# Altium schematic sheet Control.SchDoc: Control Module
size A3; SheetNumber: 2; SheetTotal: 7
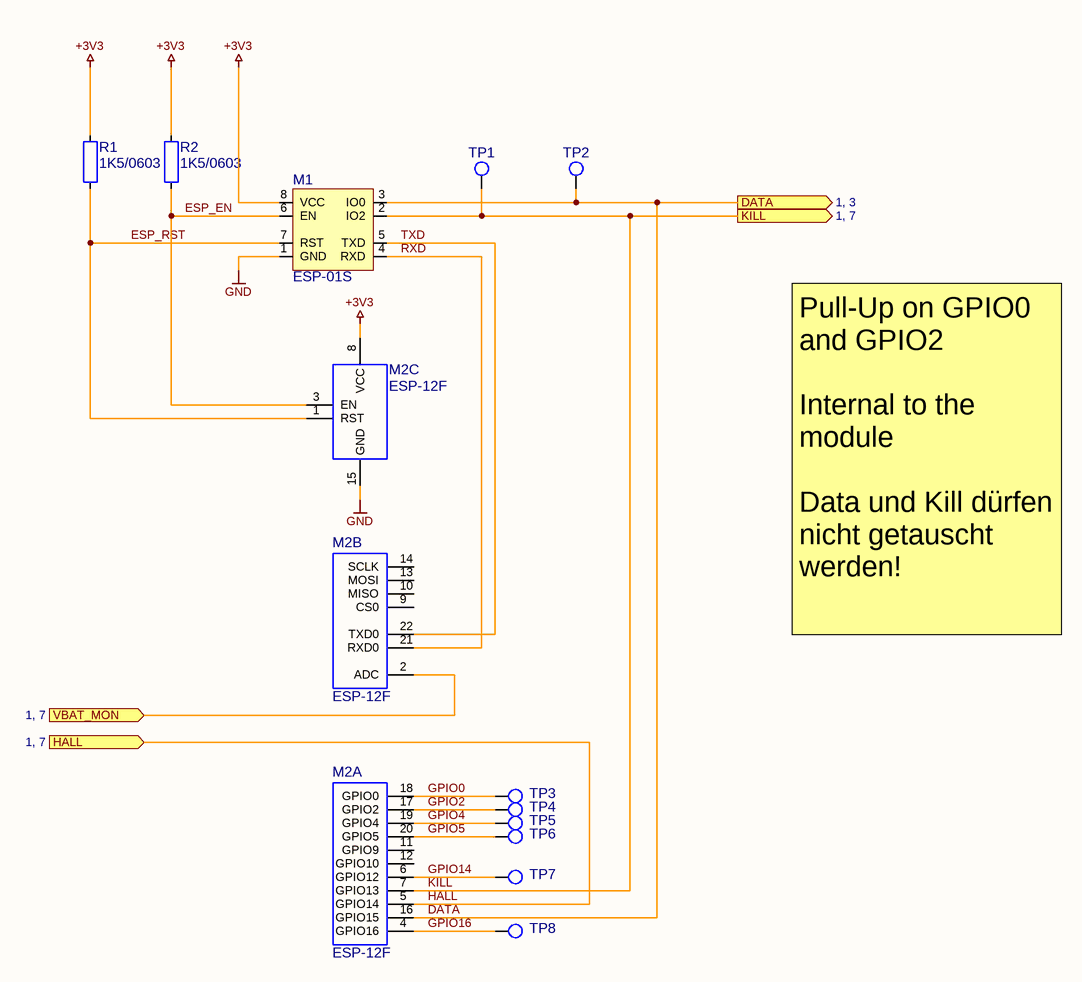
[diagram p0: Control.SchDoc]

## Parts
M1  ESP-01S  [ESP-01S]
M2  ESP-12F  [ESP-12F]  (parts A,B,C of 3)
R1  1K5/0603  [R0603-0.40-WW]
R2  1K5/0603  [R0603-0.40-WW]
TP1  TP_THD_1.5/0.8  [TP_THD_1.5/0.8]  (value not drawn)  (no BOM)
TP2  TP_THD_1.5/0.8  [TP_THD_1.5/0.8]  (value not drawn)  (no BOM)
TP3  TP_THD_1.5/0.8  [TP_THD_1.5/0.8]  (value not drawn)  (no BOM)
TP4  TP_THD_1.5/0.8  [TP_THD_1.5/0.8]  (value not drawn)  (no BOM)
TP5  TP_THD_1.5/0.8  [TP_THD_1.5/0.8]  (value not drawn)  (no BOM)
TP6  TP_THD_1.5/0.8  [TP_THD_1.5/0.8]  (value not drawn)  (no BOM)
TP7  TP_THD_1.5/0.8  [TP_THD_1.5/0.8]  (value not drawn)  (no BOM)
TP8  TP_THD_1.5/0.8  [TP_THD_1.5/0.8]  (value not drawn)  (no BOM)

## Ports
DATA (out, see 1, 3), HALL (in, see 1, 7), KILL (out, see 1, 7), VBAT_MON (in, see 1, 7)

## Nets
+3V3: M1.8(VCC) M2.8(VCC) R1.1 R2.1
GND: M1.1(GND) M2.15(GND)
DATA: M1.3(IO0) M2.16(GPIO15) TP2.1 ; port DATA
ESP_EN: M1.6(EN) M2.3(EN) R2.2
ESP_RST: M1.7(RST) M2.1(RST) R1.2
GPIO0: M2.18(GPIO0) TP3.1
GPIO2: M2.17(GPIO2) TP4.1
GPIO4: M2.19(GPIO4) TP5.1
GPIO5: M2.20(GPIO5) TP6.1
GPIO14: M2.6(GPIO12) TP7.1
GPIO16: M2.4(GPIO16) TP8.1
HALL: M2.5(GPIO14) ; port HALL
KILL: M1.2(IO2) M2.7(GPIO13) TP1.1 ; port KILL
RXD: M1.4(RXD) M2.21(RXD0)
TXD: M1.5(TXD) M2.22(TXD0)
VBAT_MON: M2.2(ADC) ; port VBAT_MON

Not connected (* = marked no-connect by the designer): M2 9(CS0) 10(MISO) 11(GPIO9) 12(GPIO10) 13(MOSI) 14(SCLK)

## Notes on the sheet
- Pull-Up on GPIO0 and GPIO2
  Internal to the module
  Data und Kill dürfen nicht getauscht werden!
- Date:
- Size:
- A3
- Schema:
- Layout:

## Library data of the parts
M1 = ESP-01S: ESP8266 based Module with 1MByte Storage; Manufacturer: AI-Thinker; Part Number: ESP-01S; Package: Board; HelpURL: https://www.microchip.ua/wireless/esp01.pdf; Manufacturer 3: Ai-Thinker; Manufacturer Part Number 3: ESP-01S; Supplier 3: LCSC; Supplier Part Number 3: C503582; JLC Type: Extended
M2 = ESP-12F: ESP8266 based Module with 4MByte Storage; Manufacturer: AI-Thinker; Part Number: ESP-12F; Package: Board; Manufacturer 3: Ai-Thinker; Manufacturer Part Number 3: ESP-12F(ESP8266MOD); Supplier 3: LCSC; Supplier Part Number 3: C82891; JLC Type: Extended
R1 R2 = 1K5/0603: RES SM 0603 1K5; Manufacturer: GENERIC; Manufacturer 1: YAGEO; Manufacturer Part Number 1: RC0603FR-131K5L; Absolute Value: 1500; Part Number: 1K5/0603; Package: 0603; Value: 1K5; HelpURL: https://www.yageo.com/upload/media/product/app/datasheet/rchip/pyu-rc_group_51_rohs_l.pdf; Supplier 1: Digi-Key; Supplier Part Number 1: 13-RC0603FR-131K5LCT-ND; Manufacturer 2: YAGEO; Manufacturer Part Number 2: RC0603FR-101K5L; Supplier 2: Digi-Key; Supplier Part Number 2: 13-RC0603FR-101K5LCT-ND; Manufacturer 3: UNI-ROYAL(Uniroyal Elec); Manufacturer Part Number 3: 0603WAF1501T5E; Supplier 3: LCSC; Supplier Part Number 3: C22843; JLC Type: Basic
TP1-TP8 = TP_THD_1.5/0.8: THT Test Point 1.5/0.8mm; Manufacturer: NONE; Part Number: TP_THD_1.5/0.8